# EAGLE schematic bottom_V2_v27 (EAGLE 9.7.0)
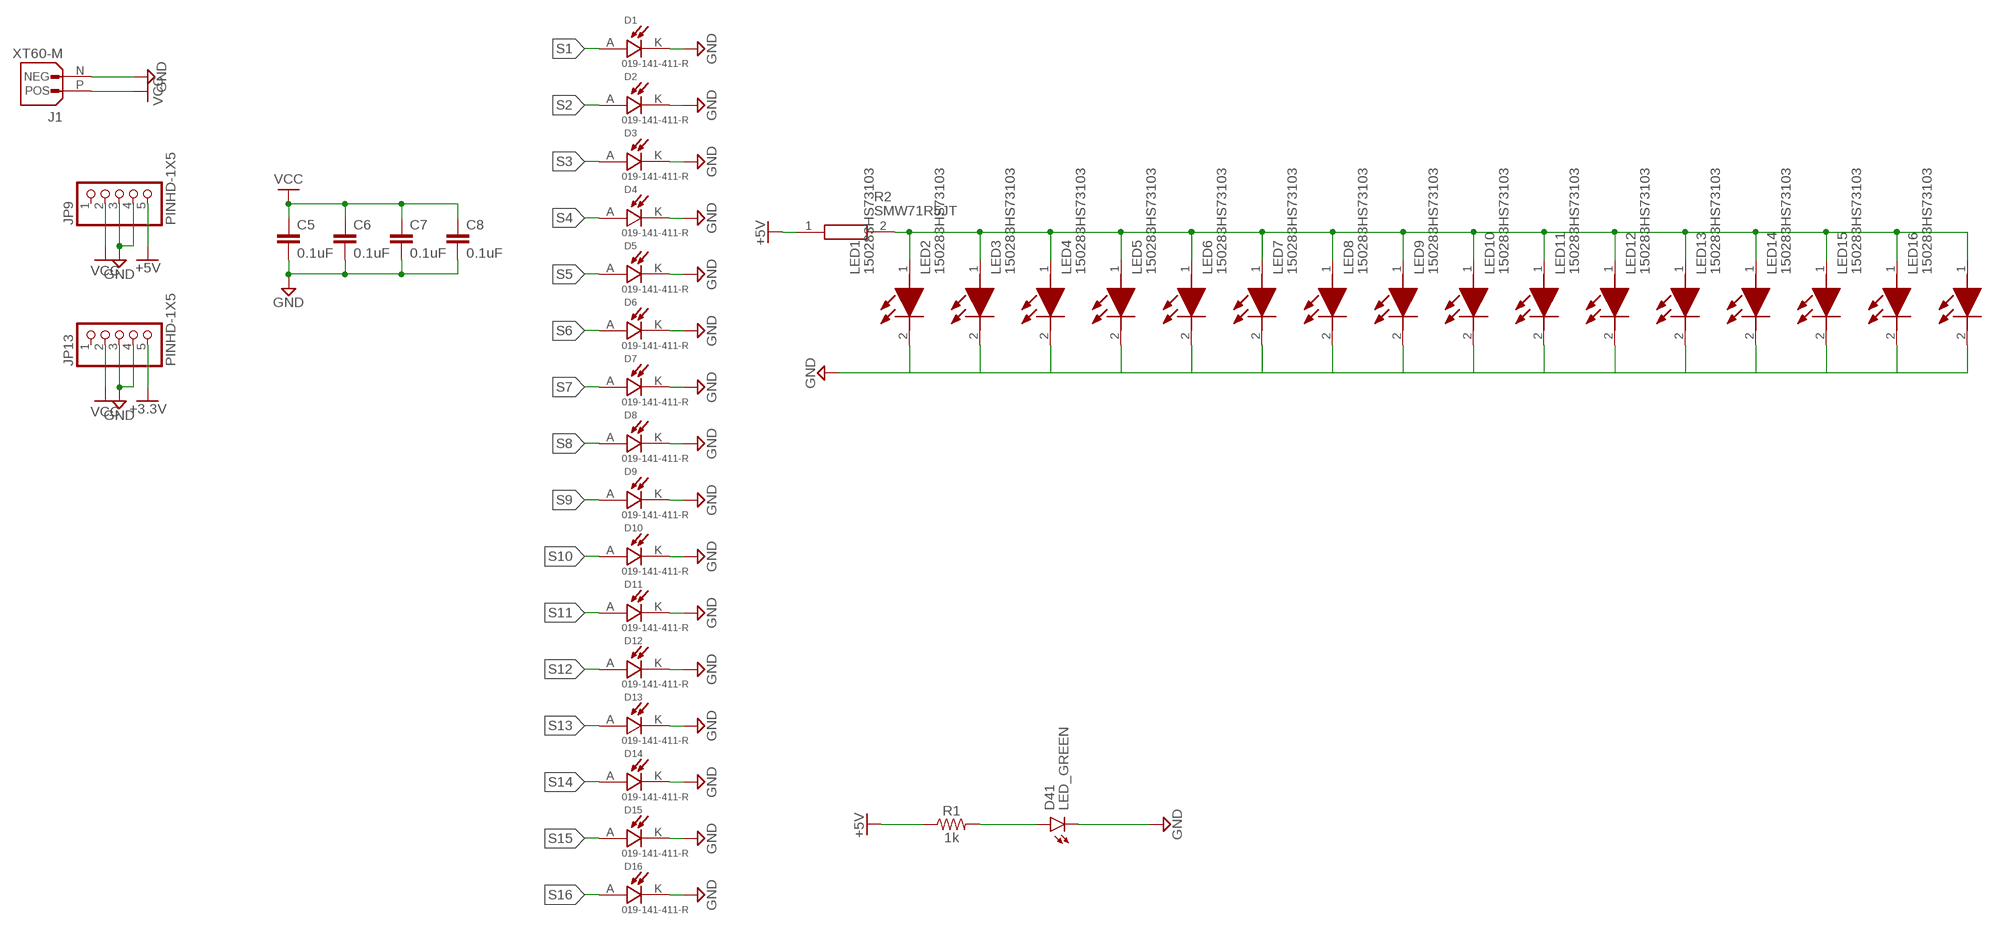
[diagram p0: schematic, sheet 1, part 1 of 2]
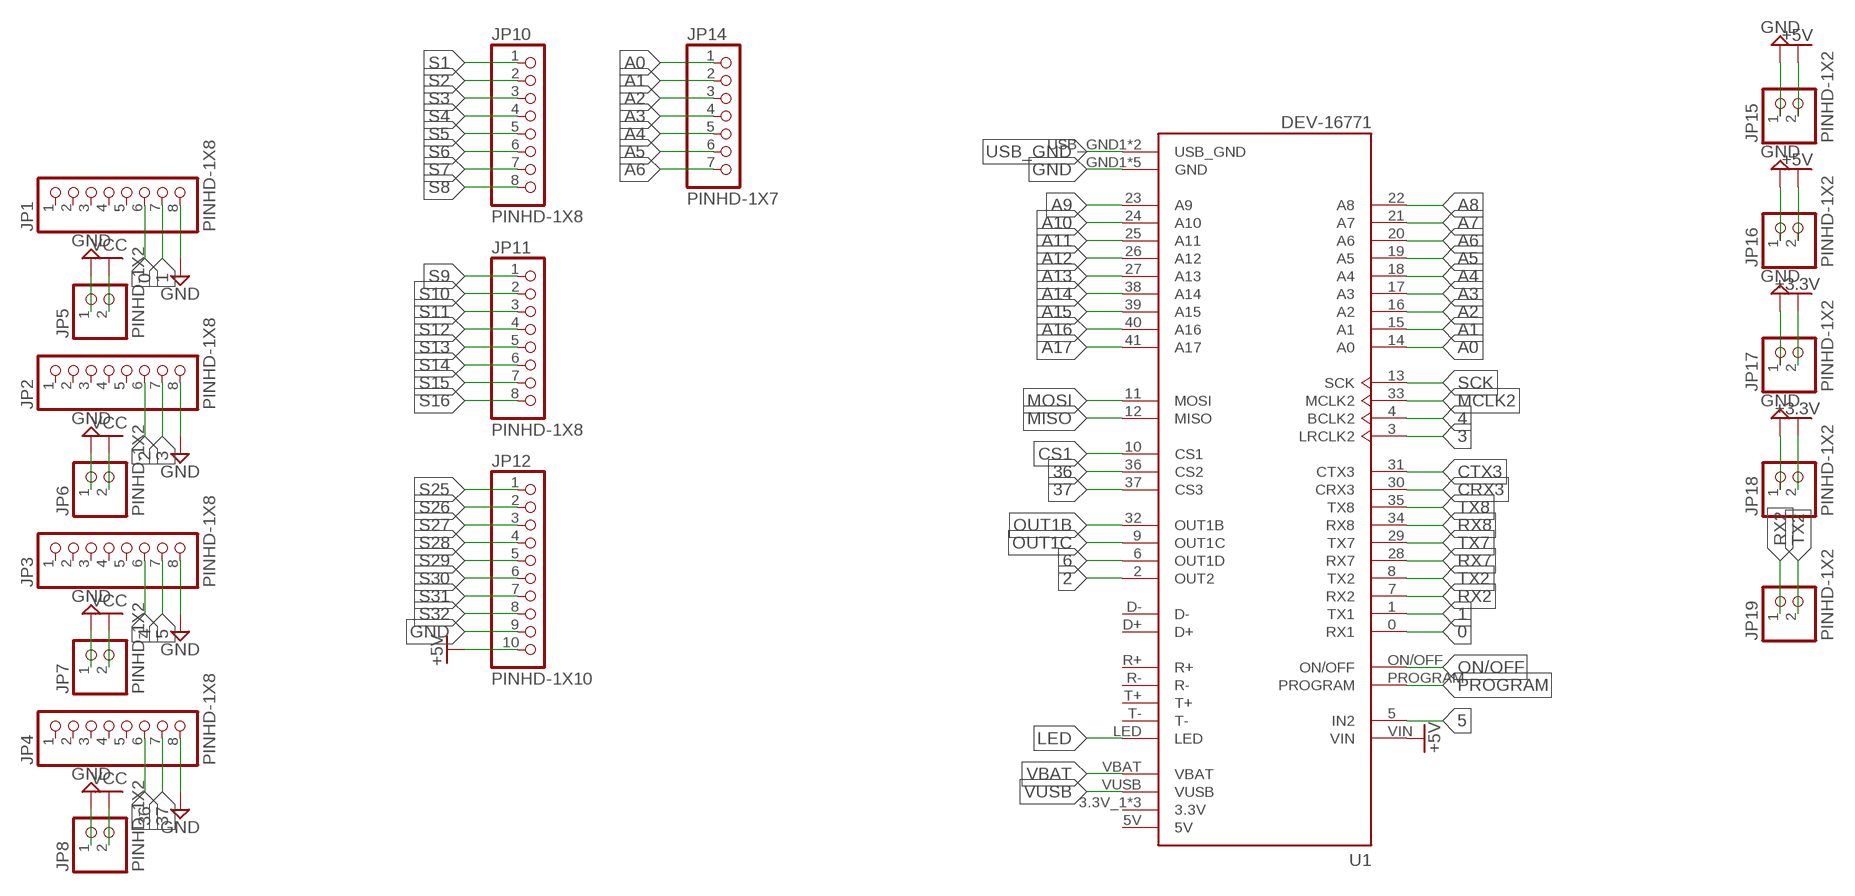
[diagram p1: schematic, sheet 1, part 2 of 2]

## Parts
C5  0.1uF  0.1UF-0402T-16V-10%  [0402-TIGHT]
C6  0.1uF  0.1UF-0402T-16V-10%  [0402-TIGHT]
C7  0.1uF  0.1UF-0402T-16V-10%  [0402-TIGHT]
C8  0.1uF  0.1UF-0402T-16V-10%  [0402-TIGHT]
D1  019-141-411-R  [DIOC2012X80N]
D2  019-141-411-R  [DIOC2012X80N]
D3  019-141-411-R  [DIOC2012X80N]
D4  019-141-411-R  [DIOC2012X80N]
D5  019-141-411-R  [DIOC2012X80N]
D6  019-141-411-R  [DIOC2012X80N]
D7  019-141-411-R  [DIOC2012X80N]
D8  019-141-411-R  [DIOC2012X80N]
D9  019-141-411-R  [DIOC2012X80N]
D10  019-141-411-R  [DIOC2012X80N]
D11  019-141-411-R  [DIOC2012X80N]
D12  019-141-411-R  [DIOC2012X80N]
D13  019-141-411-R  [DIOC2012X80N]
D14  019-141-411-R  [DIOC2012X80N]
D15  019-141-411-R  [DIOC2012X80N]
D16  019-141-411-R  [DIOC2012X80N]
D41  LED_GREEN  CHIP-FLAT-G_0402  [LEDC1005X25N_FLAT-G]
J1  XT60-M  [AMASS_XT60-M]
JP1  PINHD-1X8  [1X08]
JP2  PINHD-1X8  [1X08]
JP3  PINHD-1X8  [1X08]
JP4  PINHD-1X8  [1X08]
JP5  PINHD-1X2  [1X02]
JP6  PINHD-1X2  [1X02]
JP7  PINHD-1X2  [1X02]
JP8  PINHD-1X2  [1X02]
JP9  PINHD-1X5  [1X05]
JP10  PINHD-1X8  [1X08]
JP11  PINHD-1X8  [1X08]
JP12  PINHD-1X10  [1X10]
JP13  PINHD-1X5  [1X05]
JP14  PINHD-1X7  [1X07]
JP15  PINHD-1X2  [1X02]
JP16  PINHD-1X2  [1X02]
JP17  PINHD-1X2  [1X02]
JP18  PINHD-1X2  [1X02]
JP19  PINHD-1X2  [1X02]
LED1  150283HS73103  [150283HS73103]
LED2  150283HS73103  [150283HS73103]
LED3  150283HS73103  [150283HS73103]
LED4  150283HS73103  [150283HS73103]
LED5  150283HS73103  [150283HS73103]
LED6  150283HS73103  [150283HS73103]
LED7  150283HS73103  [150283HS73103]
LED8  150283HS73103  [150283HS73103]
LED9  150283HS73103  [150283HS73103]
LED10  150283HS73103  [150283HS73103]
LED11  150283HS73103  [150283HS73103]
LED12  150283HS73103  [150283HS73103]
LED13  150283HS73103  [150283HS73103]
LED14  150283HS73103  [150283HS73103]
LED15  150283HS73103  [150283HS73103]
LED16  150283HS73103  [150283HS73103]
R1  1k  1KOHM-0603-1/10W-1%  [0603]
R2  SMW71R5JT  [RESM24595X990N]
U1  DEV-16771  [MODULE_DEV-16771]

## Nets
0: JP1.6 U1.0(RX1)
1: JP1.7 U1.1(TX1)
2: JP2.6 U1.2(OUT2)
3: JP2.7 U1.3(LRCLK2)
4: JP3.6 U1.4(BCLK2)
5: JP3.7 U1.5(IN2)
6: U1.6(OUT1D)
36: JP4.6 U1.36(CS2)
37: JP4.7 U1.37(CS3)
+3.3V: JP13.5 JP17.2 JP18.2
+5V: JP9.5 JP12.10 JP15.2 JP16.2 R1.1 R2.1 U1.VIN
A0: JP14.1 U1.14(A0)
A1: JP14.2 U1.15(A1)
A2: JP14.3 U1.16(A2)
A3: JP14.4 U1.17(A3)
A4: JP14.5 U1.18(A4)
A5: JP14.6 U1.19(A5)
A6: JP14.7 U1.20(A6)
A7: U1.21(A7)
A8: U1.22(A8)
A9: U1.23(A9)
A10: U1.24(A10)
A11: U1.25(A11)
A12: U1.26(A12)
A13: U1.27(A13)
A14: U1.38(A14)
A15: U1.39(A15)
A16: U1.40(A16)
A17: U1.41(A17)
CRX3: U1.30(CRX3)
CS1: U1.10(CS1)
CTX3: U1.31(CTX3)
GND: C5.2 C6.2 C7.2 C8.2 D1.K(C) D2.K(C) D3.K(C) D4.K(C) D5.K(C) D6.K(C) D7.K(C) D8.K(C) D9.K(C) D10.K(C) D11.K(C) D12.K(C) D13.K(C) D14.K(C) D15.K(C) D16.K(C) D41.C J1.N(NEG) JP1.8 JP2.8 JP3.8 JP4.8 JP5.1 JP6.1 JP7.1 JP8.1 JP9.3 JP9.4 JP12.9 JP13.3 JP13.4 JP15.1 JP16.1 JP17.1 JP18.1 LED1.2(K) LED2.2(K) LED3.2(K) LED4.2(K) LED5.2(K) LED6.2(K) LED7.2(K) LED8.2(K) LED9.2(K) LED10.2(K) LED11.2(K) LED12.2(K) LED13.2(K) LED14.2(K) LED15.2(K) LED16.2(K) U1.GND1(GND) U1.GND2(GND) U1.GND3(GND) U1.GND4(GND) U1.GND5(GND)
LED: U1.LED
MCLK2: U1.33(MCLK2)
MISO: U1.12(MISO)
MOSI: U1.11(MOSI)
N$1: LED1.1(A) LED2.1(A) LED3.1(A) LED4.1(A) LED5.1(A) LED6.1(A) LED7.1(A) LED8.1(A) LED9.1(A) LED10.1(A) LED11.1(A) LED12.1(A) LED13.1(A) LED14.1(A) LED15.1(A) LED16.1(A) R2.2
N$33: D41.A R1.2
ON/OFF: U1.ON/OFF
OUT1B: U1.32(OUT1B)
OUT1C: U1.9(OUT1C)
PROGRAM: U1.PROGRAM
RX2: JP19.1 U1.7(RX2)
RX7: U1.28(RX7)
RX8: U1.34(RX8)
S1: D1.A JP10.1
S2: D2.A JP10.2
S3: D3.A JP10.3
S4: D4.A JP10.4
S5: D5.A JP10.5
S6: D6.A JP10.6
S7: D7.A JP10.7
S8: D8.A JP10.8
S9: D9.A JP11.1
S10: D10.A JP11.2
S11: D11.A JP11.3
S12: D12.A JP11.4
S13: D13.A JP11.5
S14: D14.A JP11.6
S15: D15.A JP11.7
S16: D16.A JP11.8
S25: JP12.1
S26: JP12.2
S27: JP12.3
S28: JP12.4
S29: JP12.5
S30: JP12.6
S31: JP12.7
S32: JP12.8
SCK: U1.13(SCK)
TX2: JP19.2 U1.8(TX2)
TX7: U1.29(TX7)
TX8: U1.35(TX8)
USB_GND: U1.USB_GND1(USB_GND) U1.USB_GND2(USB_GND)
VBAT: U1.VBAT
VCC: C5.1 C6.1 C7.1 C8.1 J1.P(POS) JP5.2 JP6.2 JP7.2 JP8.2 JP9.2 JP13.2
VUSB: U1.VUSB
Unconnected: JP1.1 JP1.2 JP1.3 JP1.4 JP1.5 JP2.1 JP2.2 JP2.3 JP2.4 JP2.5 JP3.1 JP3.2 JP3.3 JP3.4 JP3.5 JP4.1 JP4.2 JP4.3 JP4.4 JP4.5 JP9.1 JP13.1 U1.D+ U1.D- U1.R+ U1.R- U1.T+ U1.T-

## Power pins joined to a net without a drawn wire
3.3V: U1.3.3V_1(3.3V) U1.3.3V_2(3.3V) U1.3.3V_3(3.3V)
5V: U1.5V

## Library data of the parts
C5-C8 = SparkFun-Capacitors:0.1UF: 0.1µF ceramic capacitors A capacitor is a passive two-terminal electrical component used to store electrical energy temporarily in an electric field.; PROD_ID: CAP-12416
D1-D16 = 019-141-411-R:019-141-411-R: PHOTODIODE RED MICRO SMT; MANUFACTURER: Advanced Photonix; MAXIMUM_PACKAGE_HEIGHT: 0.8mm; PARTREV: Rev 5/7/2019; STANDARD: IPC 7351B
D41 = LED:CHIP-FLAT-G; CATEGORY: LED; COLOR: GREEN; DESCRIPTION: CHIP LED FLAT; SUB-CATEGORY: CHIP; TYPE: FLAT_TOP
J1 = XT60-M:XT60-M: Check availability <https://pricing.snapeda.com/parts/XT60-M/AMASS/view-part?ref=eda>; AVAILABILITY: Not in stock; CHECK_PRICES: https://www.snapeda.com/parts/XT60-M/AMASS/view-part/?ref=eda; DESCRIPTION: Plug; DC supply; XT60; male; PIN: 2; for cable; soldered; 30A; 500V; MF: AMASS; MP: XT60-M; PACKAGE: Package; PRICE: None; SNAPEDA_LINK: https://www.snapeda.com/parts/XT60-M/AMASS/view-part/?ref=snap
JP1-JP4 JP10 JP11 = Connector:PINHD-1X8: PIN HEADER; CATEGORY: Headers; DESCRIPTION: Header, Straight, 8 Position; MANUFACTURER: Generic; MPN: Generic; OPERATING_TEMPERATURE: Generic; PART_STATUS: Active; PITCH: 0.100" (2.54mm); ROHS_COMPLIANCE: Generic; SERIES: Generic; SUB-CATEGORY: Headers, Male Pins; TYPE: Board to Board or Cable, Unshrouded, Through Hole, Straight
JP5-JP8 JP15-JP19 = Connector:PINHD-1X2: PIN HEADER; CATEGORY: Headers; DESCRIPTION: Header, Straight, 2 Position; MANUFACTURER: Generic; MPN: Generic; OPERATING_TEMPERATURE: Generic; PART_STATUS: Active; PITCH: 0.100" (2.54mm); ROHS_COMPLIANCE: Generic; SERIES: Generic; SUB-CATEGORY: Headers, Male Pins; TYPE: Board to Board or Cable, Unshrouded, Through Hole, Straight
JP9 JP13 = Connector:PINHD-1X5: PIN HEADER; CATEGORY: Headers; DESCRIPTION: Header, Straight, 5 Position; MANUFACTURER: Generic; MPN: Generic; OPERATING_TEMPERATURE: Generic; PART_STATUS: Active; PITCH: 0.100" (2.54mm); ROHS_COMPLIANCE: Generic; SERIES: Generic; SUB-CATEGORY: Headers, Male Pins; TYPE: Board to Board or Cable, Unshrouded, Through Hole, Straight
JP12 = Connector:PINHD-1X10: PIN HEADER; CATEGORY: Headers; DESCRIPTION: Header, Straight, 10 Position; MANUFACTURER: Generic; MPN: Generic; OPERATING_TEMPERATURE: Generic; PART_STATUS: Active; PITCH: 0.100" (2.54mm); ROHS_COMPLIANCE: Generic; SERIES: Generic; SUB-CATEGORY: Headers, Male Pins; TYPE: Board to Board or Cable, Unshrouded, Through Hole, Straight
JP14 = Connector:PINHD-1X7: PIN HEADER; CATEGORY: Headers; DESCRIPTION: Header, Straight, 7 Position; MANUFACTURER: Generic; MPN: Generic; OPERATING_TEMPERATURE: Generic; PART_STATUS: Active; PITCH: 0.100" (2.54mm); ROHS_COMPLIANCE: Generic; SERIES: Generic; SUB-CATEGORY: Headers, Male Pins; TYPE: Board to Board or Cable, Unshrouded, Through Hole, Straight
LED1-LED16 = 150283HS73103:150283HS73103: Standard LEDs - SMD WL-SMTW Wtrclr TopVw Hrt 2.2V 150mA 660nm Source: Datasheet <https://www.we-online.com/catalog/datasheet/150283HS73103.pdf>; DESCRIPTION: Standard LEDs - SMD WL-SMTW Wtrclr TopVw Hrt 2.2V 150mA 660nm; HEIGHT: 0.85mm; MANUFACTURER_NAME: Wurth Elektronik; MANUFACTURER_PART_NUMBER: 150283HS73103; MOUSER_PART_NUMBER: 710-150283HS73103; MOUSER_PRICE-STOCK: https://www.mouser.co.uk/ProductDetail/Wurth-Elektronik/150283HS73103?qs=GedFDFLaBXH95OYexHSCsg%3D%3D
R1 = SparkFun-Resistors:1KOHM: 1kΩ resistor A resistor is a passive two-terminal electrical component that implements electrical resistance as a circuit element. Resistors act to reduce current flow, and, at the same time, act to lower voltage levels within circuits. - Wikipedia; PROD_ID: RES-07856
R2 = SMW71R5JT:SMW71R5JT: Configuration Features: Number of Resistors 1 | Dimensions: Product Height .378 INCH | Product Height 9.6 MM | Product Width 9.5 MM | Product Length .906 INCH | Product Width .374 INCH | Product Length 23 MM | Electrical Characteristics: Resistance Value 1.5 OHM | Passive Component Tolerance 5 PCT | Resistance Class Up to 1k | Power Rating 7 WATT | Packaging Features: Packaging Method Taped & Reeled | Product Type Features: Element Type Wire Wound | Resistor Type Power Resistor | Termination Features: Sur Source: Datasheet <https://www.te.com/commerce/DocumentDelivery/DDEController?Action=srchrtrv&DocNm=1773242&DocType=Data Sheet&DocLang=English&PartCntxt=2-2176459-9&DocFormat=pdf>; DESCRIPTION: Configuration Features: Number of Resistors 1 | Dimensions: Product Height .378 INCH | Product Height 9.6 MM | Product Width 9.5 MM | Product Length .906 INCH | Product Width .374 INCH | Product Length 23 MM | Electrical Characteristics: Resistance Value 1.5 OHM | Passive Component Tolerance 5 PCT | Resistance Class Up to 1k | Power Rating 7 WATT | Packaging Features: Packaging Method Taped & Reeled | Product Type Features: Element Type Wire Wound | Resistor Type Power Resistor | Termination Features: Sur; HEIGHT: 9.9mm; MANUFACTURER_NAME: TE Connectivity; MANUFACTURER_PART_NUMBER: SMW71R5JT; MOUSER_PART_NUMBER: 279-SMW71R5JT; MOUSER_PRICE-STOCK: https://www.mouser.co.uk/ProductDetail/TE-Connectivity-Holsworthy/SMW71R5JT?qs=zW32dvEIR3v4pGMAHBLPRg%3D%3D
U1 = DEV-16771:DEV-16771: RT1062 Teensy 4.1 i.MX ARM Cortex-M7 MPU Embedded Evaluation Board Check availability <https://pricing.snapeda.com/parts/DEV-16771/SparkFun%20Electronics/view-part?ref=eda>; AVAILABILITY: In Stock; CHECK_PRICES: https://www.snapeda.com/parts/DEV-16771/SparkFun+Electronics/view-part/?ref=eda; DESCRIPTION: RT1062 Teensy 4.1 series ARM® Cortex®-M7 MPU Embedded Evaluation Board; MF: SparkFun Electronics; MP: DEV-16771; PACKAGE: None; PRICE: None; PURCHASE-URL: https://www.snapeda.com/api/url_track_click_mouser/?unipart_id=4833875&manufacturer=SparkFun Electronics&part_name=DEV-16771&search_term=None; SNAPEDA_LINK: https://www.snapeda.com/parts/DEV-16771/SparkFun+Electronics/view-part/?ref=snap